# EAGLE schematic Shutdown Circuit (EAGLE 9.6.2)
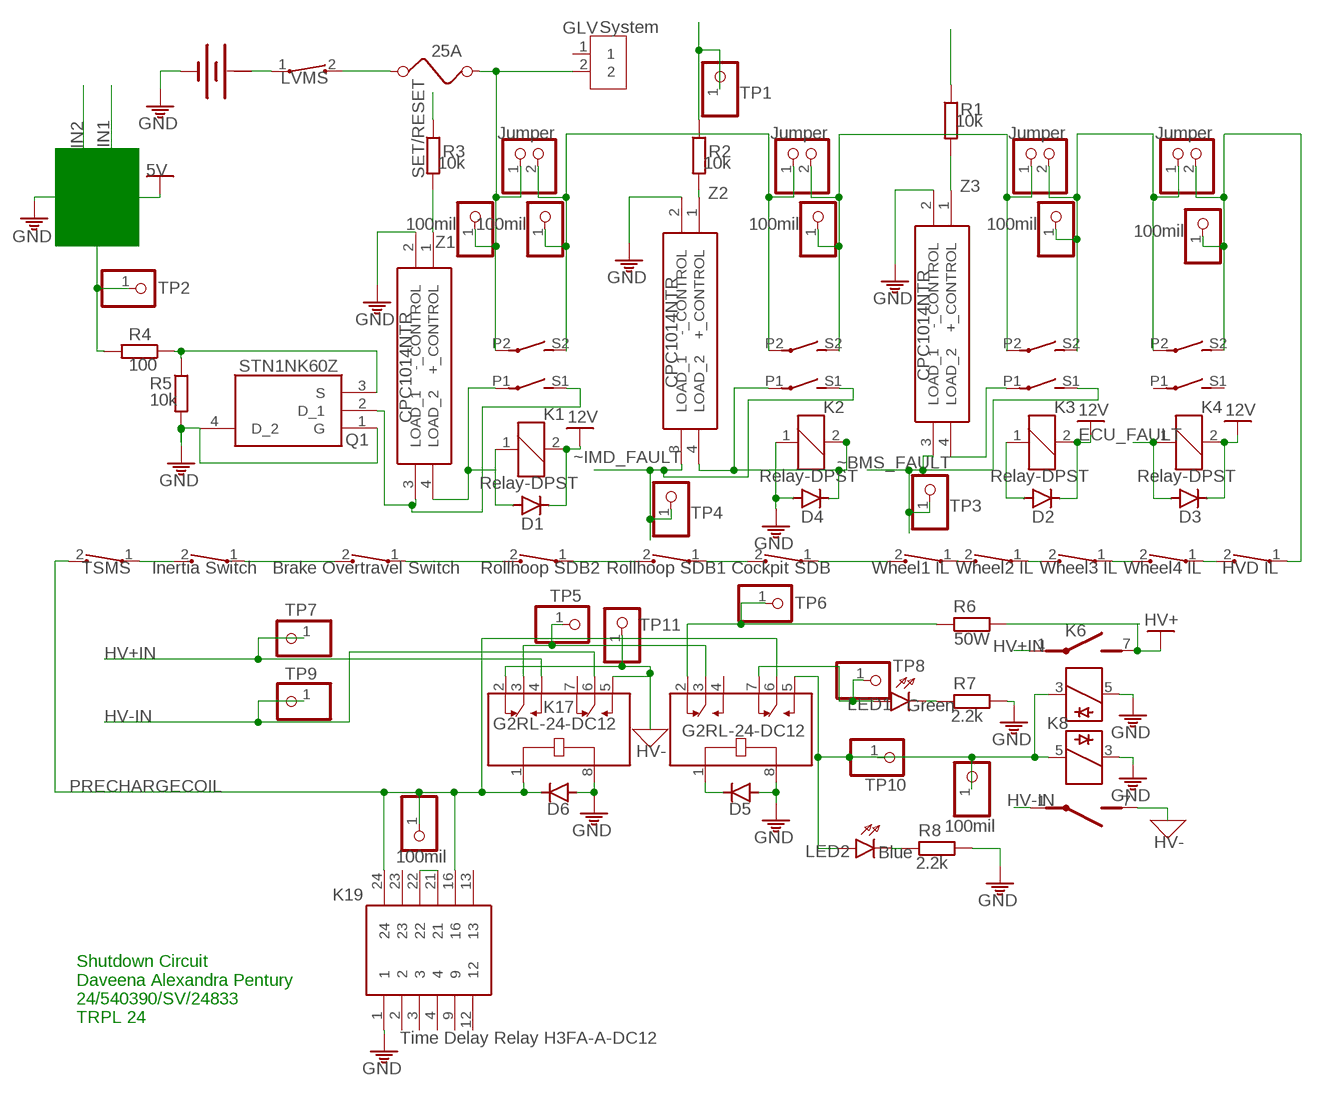
[diagram p0: schematic, sheet 1]

## Parts
BAT1  BATTERY  [BATTERY]
D1  1N4942  [DO41-10]
D2  1N4942  [DO41-10]
D3  1N4942  [DO41-10]
D4  1N4942  [DO41-10]
D5  1N4004  [DO41-10]
D6  1N4004  [DO41-10]
F1  25A  FUSE  [FUSE]
GLV  System  2828XX-2282834-2  [TERMBLK_254-2N]
J1  Jumper  PINHD-1X2  [1X02]
JP6  100mil  PINHD-1X1  [1X01]
JP7  100mil  PINHD-1X1  [1X01]
JP8  100mil  PINHD-1X1  [1X01]
JP9  100mil  PINHD-1X1  [1X01]
JP16  100mil  PINHD-1X1  [1X01]
JP17  100mil  PINHD-1X1  [1X01]
JP18  100mil  PINHD-1X1  [1X01]
JUMPER1  Jumper  PINHD-1X2  [1X02]
JUMPER2  Jumper  PINHD-1X2  [1X02]
JUMPER3  Jumper  PINHD-1X2  [1X02]
K1  Relay-DPST  G2R2A  [G2R2A]
K2  Relay-DPST  G2R2A  [G2R2A]
K3  Relay-DPST  G2R2A  [G2R2A]
K4  Relay-DPST  G2R2A  [G2R2A]
K6  35701331  [REED]
K8  35701331  [REED]
K15  G2RL-24-DC12  [RELAY_G2RL-24-DC12]
K17  G2RL-24-DC12  [RELAY_G2RL-24-DC12]
K19  Time Delay Relay H3FA-A-DC12  H3FA-A-DC12  [H3FA-A]
LED1  Green  HLMP6  [HLMP6]
LED2  Blue  HLMP6  [HLMP6]
Q1  STN1NK60Z  [SOT230P700X190-4N]
R1  10k  R  (no package)
R2  10k  R  (no package)
R3  10k  R  (no package)
R4  100  R  (no package)
R5  10k  R  (no package)
R6  50W  R  (no package)
R7  2.2k  R  (no package)
R8  2.2k  R  (no package)
SW1  HVD IL  CT10-XXXX-G1  [CT10-XXXX-G1]
SW2  Wheel4 IL  CT10-XXXX-G1  [CT10-XXXX-G1]
SW3  Wheel3 IL  CT10-XXXX-G1  [CT10-XXXX-G1]
SW4  Wheel2 IL  CT10-XXXX-G1  [CT10-XXXX-G1]
SW5  Wheel1 IL  CT10-XXXX-G1  [CT10-XXXX-G1]
SW6  Cockpit SDB  CT10-XXXX-G1  [CT10-XXXX-G1]
SW7  Brake Overtravel Switch  CT10-XXXX-G1  [CT10-XXXX-G1]
SW8  Rollhoop SDB1  CT10-XXXX-G1  [CT10-XXXX-G1]
SW9  Rollhoop SDB2  CT10-XXXX-G1  [CT10-XXXX-G1]
SW10  Inertia Switch  CT10-XXXX-G1  [CT10-XXXX-G1]
SW11  TSMS  CT10-XXXX-G1  [CT10-XXXX-G1]
SW12  LVMS  CT10-XXXX-A2  [CT10-XXXX-A2]
TP1  PINHD-1X1  [1X01]
TP2  PINHD-1X1  [1X01]
TP3  PINHD-1X1  [1X01]
TP4  PINHD-1X1  [1X01]
TP5  PINHD-1X1  [1X01]
TP6  PINHD-1X1  [1X01]
TP7  PINHD-1X1  [1X01]
TP8  PINHD-1X1  [1X01]
TP9  PINHD-1X1  [1X01]
TP10  PINHD-1X1  [1X01]
TP11  PINHD-1X1  [1X01]
Z1  CPC1014NTR  [SOP254P610X218-4N]
Z2  CPC1014NTR  [SOP254P610X218-4N]
Z3  CPC1014NTR  [SOP254P610X218-4N]

## Nets
ECU_FAULT: D3.A K4.1
GND: D1.C K1.2 K6.7(2:S) ; supply symbol labelled HV+, 12V
HV+IN: K6.1(2:P) K17.4(NO1) TP7.1
HV-: K8.7(2:S) K17.2(NC1) K17.5(NO2) TP11.1
HV-IN: K8.1(2:P) K17.6(COM2) TP9.1
N$1: K19.21 K19.22
N$3: JUMPER1.2
N$4: JP18.1
N$5: D5.C K15.1(COIL1)
N$6: JP9.1
N$7: K15.3(COM1) K17.3(COM1) TP5.1
N$8: JP16.1 K6.3 K8.5 K15.5(NO2) LED2.A TP10.1
N$9: LED2.K R8.1
N$10: K15.7(NC2) LED1.A TP8.1
N$11: LED1.K R7.1
N$14: R6.2
N$15: K15.2(NC1) R6.1 TP6.1
N$16: SW10.2 SW11.1
N$17: SW7.2 SW10.1
N$18: SW7.1 SW9.2
N$19: SW8.2 SW9.1
N$20: SW6.2 SW8.1
N$21: SW5.2 SW6.1
N$22: SW4.2 SW5.1
N$23: SW3.2 SW4.1
N$24: SW2.2 SW3.1
N$25: SW1.2 SW2.1
N$28: D3.C K4.2 ; supply symbol labelled 12V
N$29: K4.S2(3:S) SW1.1
N$30: JP6.1 JUMPER3.2 K3.S2(3:S) K4.P2(3:P)
N$31: JUMPER1.1
N$34: D2.C K3.2 ; supply symbol labelled 12V
N$35: D2.A K3.1
N$36: K3.P1(2:P) Z3.4(LOAD_2)
N$39: R1.2 Z3.1(+_CONTROL)
N$40: JP7.1 JUMPER2.2 JUMPER3.1 K3.P2(3:P)
N$41: D4.C K2.2 K2.P1(2:P) Z2.4(LOAD_2)
N$44: R2.2 Z2.1(+_CONTROL)
N$45: R1.1
N$46: R2.1 TP1.1
N$47: J1.2 JP8.1 JUMPER2.1 K2.P2(3:P)
N$48: R3.2 Z1.1(+_CONTROL)
N$49: D1.A K1.1
N$50: F1.1 GLV.2 J1.1 K1.P2(3:P)
N$52: F1.2 SW12.2
N$53: K1.P1(2:P) Z1.4(LOAD_2)
N$54: BAT1.+ SW12.1
N$55: K1.S1(2:S) Q1.2(D_1) Z1.3(LOAD_1)
N$56: Q1.3(S) R4.1 R5.1
N$57: R4.2 TP2.1
PE: BAT1.- D4.A D5.A D6.A K2.1 K6.5 K8.3 K15.8(COIL2) K17.8(COIL2) K19.1 Q1.1(G) Q1.4(D_2) R5.2 R7.2 R8.2 Z1.2(-_CONTROL) Z2.2(-_CONTROL) Z3.2(-_CONTROL) ; supply symbol labelled GND
PRECHARGECOIL: D6.C JP17.1 K15.6(COM2) K17.1(COIL1) K19.16 K19.24 SW11.2
SET/RESET: R3.1
~BMS_FAULT: K3.S1(2:S) TP3.1 Z3.3(LOAD_1)
~IMD_FAULT: K2.S1(2:S) TP4.1 Z2.3(LOAD_1)
Unconnected: GLV.1 K1.S2(3:S) K2.S2(3:S) K4.P1(2:P) K4.S1(2:S) K15.4(NO1) K17.7(NC2) K19.2 K19.3 K19.4 K19.9 K19.12 K19.13 K19.23

## Notes on the sheet
- Shutdown Circuit
  Daveena Alexandra Pentury
  24/540390/SV/24833
  TRPL 24

## Power pins joined to a net without a drawn wire
+: BAT1.+@1(+)

## Library data of the parts
BAT1 = special:BATTERY: BATTERY
D1-D4 = diode:1N4942: DIODE 1.0 A, 200 V, 150 ns
D5 D6 = diode:1N4004: DIODE general purpose rectifier, 1 A
F1 = special:FUSE: FUSE 5 x 20 mm
GLV = Connector:2828XX-2: 2 Position Wire to Board Terminal Block Horizontal with Board Datasheet <https://www.te.com.cn/commerce/DocumentDelivery/DDEController?Action=showdoc&DocId=Catalog+Section%7F1308389_EUROSTYLE_TERMINAL_BLOCKS%7F0607%7Fpdf%7FEnglish%7FENG_CS_1308389_EUROSTYLE_TERMINAL_BLOCKS_0607.pdf%7F2-282837-5>; CATEGORY: Fixed Terminal Blocks; DATASHEET: https://www.te.com/usa-en/product-282834-2.datasheet.pdf; DESCRIPTION: 2 Position Wire to Board Terminal Block Horizontal with Board 0.100" (2.54mm) Through Hole; MANUFACTURER: TE Connectivity AMP Connectors; MPN: 282834-2; OPERATING_TEMPERATURE: -40°C ~ 105°C; PACKAGE_SIZE: NA; PACKAGE_TYPE: THT; PART_STATUS: ACTIVE; PITCH: 0.100" (2.54mm); ROHS: COMPLIANT; SERIES: Buchanan; SUBCATEGORY: Terminal Blocks; TYPE: Through Hole Screw - Rising Cage Clamp Side wire entry Horizontal with Board
J1 JUMPER1-JUMPER3 = Connector:PINHD-1X2: PIN HEADER; CATEGORY: Headers; DESCRIPTION: Header-Straight-2 Position; PACKAGE_TYPE: THT; PITCH: 0.100" (2.54mm); SUBCATEGORY: Headers-Male Pins; TYPE: Board to Board or Cable-Unshrouded-Through Hole-Straight
JP6-JP9 JP16-JP18 = pinhead:PINHD-1X1: PIN HEADER
K1-K4 = relay:G2R2A: RELAY 2 x norm. open, Omron; MPN: G2R-2A-DC24; OC_FARNELL: 6985269; OC_NEWARK: 36M5257
K6 K8 = relay:35701331: RELAY reed, 1 x norm. open with polarity; OC_FARNELL: unknown; OC_NEWARK: unknown
K15 K17 = G2RL-24-DC12:G2RL-24-DC12: Check availability <https://pricing.snapeda.com/parts/G2RL-24-DC12/Omron%20Electronics/view-part?ref=eda>; AVAILABILITY: In Stock; CHECK_PRICES: https://www.snapeda.com/parts/G2RL-24-DC12/Omron+Electronics+Inc-EMC+Div/view-part/?ref=eda; DESCRIPTION: General Purpose Relay DPDT (2 Form C) 12VDC Coil Through Hole; MF: Omron Electronics; MP: G2RL-24-DC12; PACKAGE: None; PRICE: None; SNAPEDA_LINK: https://www.snapeda.com/parts/G2RL-24-DC12/Omron+Electronics+Inc-EMC+Div/view-part/?ref=snap
K19 = H3FA-A-DC12:H3FA-A-DC12: Time Delay & Timing Relays 12VDC 1s-10m Contact SPST-NO+SPST-NC Source: Datasheet <https://datasheet.datasheetarchive.com/originals/distributors/Datasheets_SAMA/a928313e8d77a16c47ee4c730be1d562.pdf>; DESCRIPTION: Time Delay & Timing Relays 12VDC 1s-10m Contact SPST-NO+SPST-NC; HEIGHT: mm; MANUFACTURER_NAME: Omron Electronics; MANUFACTURER_PART_NUMBER: H3FA-A-DC12; MOUSER_PART_NUMBER: 653-H3FA-A-DC12; MOUSER_PRICE-STOCK: https://www.mouser.co.uk/ProductDetail/Omron-Automation-and-Safety/H3FA-A-DC12?qs=sH%2FZhVe34avVq7p0BQX0dw%3D%3D
LED1 LED2 = display-hp:HLMP6: LED 2mm horizontal; MF: AGILENT TECHNOLOGIES; MPN: HLMP-6500; OC_FARNELL: 1652490; OC_NEWARK: 40K0088
Q1 = STN1NK60Z:STN1NK60Z: STN1NK60Z, N-channel MOSFET Transistor 0.3 A 600 V, 4-Pin SOT-223 Source: Datasheet <http://www.st.com/web/en/resource/technical/document/datasheet/CD00003347.pdf>; ARROW_PART_NUMBER: STN1NK60Z; ARROW_PRICE-STOCK: https://www.arrow.com/en/products/stn1nk60z/stmicroelectronics; DESCRIPTION: STN1NK60Z, N-channel MOSFET Transistor 0.3 A 600 V, 4-Pin SOT-223; HEIGHT: 1.9mm; MANUFACTURER_NAME: STMicroelectronics; MANUFACTURER_PART_NUMBER: STN1NK60Z; MOUSER_PART_NUMBER: 511-STN1NK60Z; MOUSER_PRICE-STOCK: https://www.mouser.co.uk/ProductDetail/STMicroelectronics/STN1NK60Z/?qs=%252BX2uje6VeKUJVH4dy5ybXw%3D%3D
R1-R8 = ngspice-simulation:R: RESISTOR
SW1-SW12 = switch-coto:CT10-XXXX-: CT10 Series Molded Switch Source: www.cotorelay.com .. Coto_Technology__CT10-1530-G1.pdf
TP1-TP11 = Connector:PINHD-1X1: PIN HEADER; CATEGORY: Headers; DESCRIPTION: Header-Straight-1 Position; PACKAGE_TYPE: THT; PITCH: 0.100" (2.54mm); SUBCATEGORY: Headers-Male Pins; TYPE: Board to Board or Cable-Unshrouded-Through Hole-Straight
Z1-Z3 = CPC1014NTR:CPC1014NTR: Solid State Relays - PCB Mount 1-Form-A 60V 400mA Solid State Relay Source: Datasheet <http://www.ixysic.com/home/pdfs.nsf/www/CPC1014N.pdf/$file/CPC1014N.pdf>; ARROW_PART_NUMBER: CPC1014NTR; ARROW_PRICE-STOCK: https://www.arrow.com/en/products/cpc1014ntr/littelfuse?region=nac; DESCRIPTION: Solid State Relays - PCB Mount 1-Form-A 60V 400mA Solid State Relay; HEIGHT: 2.184mm; MANUFACTURER_NAME: LITTELFUSE; MANUFACTURER_PART_NUMBER: CPC1014NTR; MOUSER_PART_NUMBER: 849-CPC1014NTR; MOUSER_PRICE-STOCK: https://www.mouser.co.uk/ProductDetail/IXYS-Integrated-Circuits/CPC1014NTR?qs=OpMkDkHXivN5952qPD9TVQ%3D%3D